# Altium schematic sheet Sheet4.SchDoc
size 209 x 297 mm; Razrabotal: {Разработал}; Prov: {Проверил}; Tkont: {Т. конт.}; Nkont: {Н. конт.}; Utv: {Утвердил}; Naimenovanie: {Наименование}; Oboznachenie: {Обозначение}; Shifr: {Шифр}
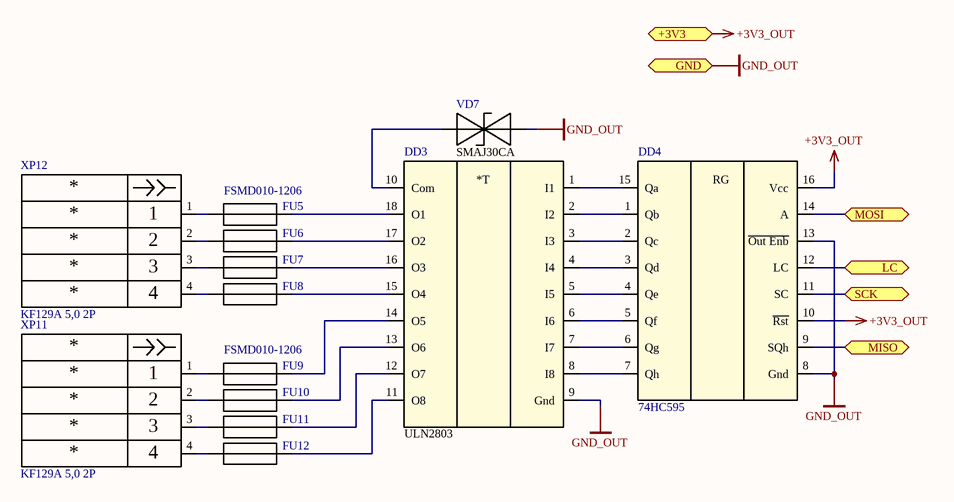
[diagram p0: Sheet4.SchDoc]

## Parts
DD3  ULN2803  [SO18 S1.27W9.9]
DD4  74НС595  [SO16 S1.27W6.00]
FU5  FSMD010-1206  [Fuse 1206]
FU6  FSMDxxx-1206  [Fuse 1206]  (value not drawn)
FU7  FSMDxxx-1206  [Fuse 1206]  (value not drawn)
FU8  FSMDxxx-1206  [Fuse 1206]  (value not drawn)
FU9  FSMD010-1206  [Fuse 1206]
FU10  FSMDxxx-1206  [Fuse 1206]  (value not drawn)
FU11  FSMDxxx-1206  [Fuse 1206]  (value not drawn)
FU12  FSMDxxx-1206  [Fuse 1206]  (value not drawn)
VD7  SMAJ30CA  [DO-214AC SMA]
XP11  KF129A 5,0 2P  [KF129A 5,0 2P]
XP12  KF129A 5,0 2P  [KF129A 5,0 2P]

## Ports
+3V3, GND, LC, MISO, MOSI, SCK

## Nets
+3V3_OUT: DD4.10(~{Rst}) DD4.16(Vcc) ; port +3V3
GND_OUT: DD3.9(Gnd) DD4.8(Gnd) DD4.13(~{Out_Enb}) VD7.1 ; port GND
LC: DD4.12(LC) ; port LC
MISO: DD4.9(SQh) ; port MISO
MOSI: DD4.14(A) ; port MOSI
SCK: DD4.11(SC) ; port SCK
NetDD3_1: DD3.1(I1) DD4.15(Qa)
NetDD3_2: DD3.2(I2) DD4.1(Qb)
NetDD3_3: DD3.3(I3) DD4.2(Qc)
NetDD3_4: DD3.4(I4) DD4.3(Qd)
NetDD3_5: DD3.5(I5) DD4.4(Qe)
NetDD3_6: DD3.6(I6) DD4.5(Qf)
NetDD3_7: DD3.7(I7) DD4.6(Qg)
NetDD3_8: DD3.8(I8) DD4.7(Qh)
NetDD3_10: DD3.10(Com) VD7.2
NetDD3_11: DD3.11(O8) FU12.2
NetDD3_12: DD3.12(O7) FU11.2
NetDD3_13: DD3.13(O6) FU10.2
NetDD3_14: DD3.14(O5) FU9.2
NetDD3_15: DD3.15(O4) FU8.2
NetDD3_16: DD3.16(O3) FU7.2
NetDD3_17: DD3.17(O2) FU6.2
NetDD3_18: DD3.18(O1) FU5.2
NetFU5_1: FU5.1 XP12.1
NetFU6_1: FU6.1 XP12.2
NetFU7_1: FU7.1 XP12.3
NetFU8_1: FU8.1 XP12.4
NetFU9_1: FU9.1 XP11.1
NetFU10_1: FU10.1 XP11.2
NetFU11_1: FU11.1 XP11.3
NetFU12_1: FU12.1 XP11.4

## Notes on the sheet
- Перв. примен.
- Спра. №
- Подп. и дата
- Инв. № бубл.
- Взам. инв. №
- Инв. № подл.
- Лист
- Изм
- № докум.
- Подпись
- Дата
- Копировал
- Формат А4
- (in symbol 74НС595) RG
- (in symbol ULN2803) *T

## Library data of the parts
FU5 FU9 = FSMDxxx-1206: Comments: *
VD7 = SMAJxxCA: Comments: *
DD4 = 74НС595: Comments: *
FU6-FU8 FU10-FU12 = FSMDxxx-1206: Comments: *
XP11 XP12 = KF129A 5,0 2P: Comments: *; Name1: *; Name2: *; Name3: *; Name: *; Name4: *